# Altium schematic sheet dianshe1yuanli.SchDoc
size A4
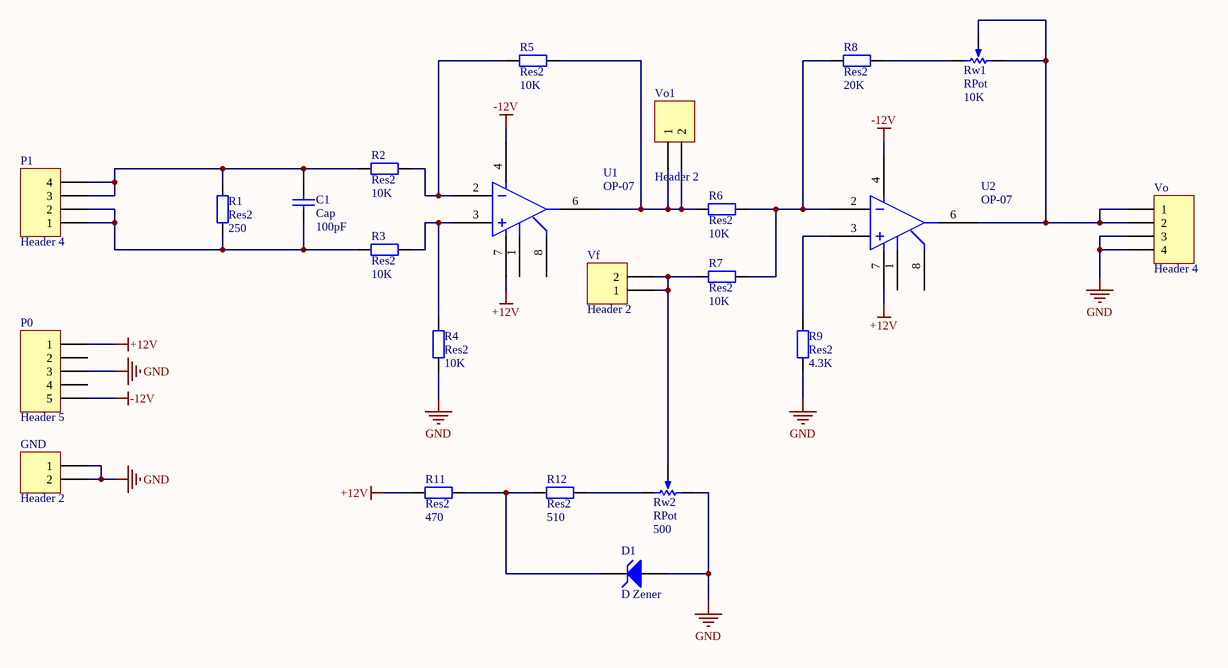
[diagram p0: dianshe1yuanli.SchDoc]

## Parts
C1  Cap  value 100pF  [RAD0.2]
D1  D Zener  [DIODE0.4]
GND  Header 2  [SIP2]
P0  Header 5  [POWER PLUG5]
P1  Header 4  [SIP4]
R1  Res2  value 250  [AXIAL-0.4]
R2  Res2  value 10K  [AXIAL-0.4]
R3  Res2  value 10K  [AXIAL-0.4]
R4  Res2  value 10K  [AXIAL-0.4]
R5  Res2  value 10K  [AXIAL-0.4]
R6  Res2  value 10K  [AXIAL-0.4]
R7  Res2  value 10K  [AXIAL-0.4]
R8  Res2  value 20K  [AXIAL-0.4]
R9  Res2  value 4.3K  [AXIAL-0.4]
R11  Res2  value 470  [AXIAL-0.4]
R12  Res2  value 510  [AXIAL-0.4]
Rw1  RPot  value 10K  [VR5]
Rw2  RPot  value 500  [VR5]
U1  OP-07  [DIP-8]
U2  OP-07  [DIP-8]
Vf  Header 2  [SIP2]
Vo  Header 4  [SIP4]
Vo1  Header 2  [SIP2]

## Nets
+12V: P0.1 R11.1 U1.7 U2.7
-12V: P0.5 U1.4 U2.4
GND: D1.1(A) GND.1 GND.2 P0.3 R4.1 R9.1 Rw2.1(TOP) Vo.3 Vo.4
NetC1_1: C1.1 P1.1 P1.2 R1.1 R3.1
NetC1_2: C1.2 P1.3 P1.4 R1.2 R2.1
NetD1_2: D1.2(K) R11.2 R12.1
NetR2_2: R2.2 R5.1 U1.2
NetR3_2: R3.2 R4.2 U1.3
NetR5_2: R5.2 R6.1 U1.6 Vo1.1 Vo1.2
NetR6_2: R6.2 R7.2 R8.1 U2.2
NetR7_1: R7.1 Rw2.2(TAP) Vf.1 Vf.2
NetR8_2: R8.2 Rw1.3(BOT)
NetR9_2: R9.2 U2.3
NetR12_2: R12.2 Rw2.3(BOT)
NetRw1_1: Rw1.1(TOP) Rw1.2(TAP) U2.6 Vo.1 Vo.2

Not connected (* = marked no-connect by the designer): P0 2 4; U1 1 8; U2 1 8

## Library data of the parts
C1 = Cap: Capacitor; Published: 8-Jun-2000; LatestRevisionDate: 17-Jul-2002; LatestRevisionNote: Re-released for DXP Platform.; PackageReference: RAD-0.3; Publisher: Altium Limited
D1 = D Zener: Zener Diode; Published: 8-Jun-2000; LatestRevisionDate: 17-Jul-2002; LatestRevisionNote: Re-released for DXP Platform.; PackageReference: DIODE-0.7; Publisher: Altium Limited
GND Vf Vo1 = Header 2: Header, 2-Pin; LatestRevisionDate: 17-Jul-2002; LatestRevisionNote: Re-released for DXP Platform.; Publisher: Altium Limited
P0 = Header 5: Header, 5-Pin; LatestRevisionDate: 17-Jul-2002; LatestRevisionNote: Re-released for DXP Platform.; Publisher: Altium Limited
P1 Vo = Header 4: Header, 4-Pin; LatestRevisionDate: 17-Jul-2002; LatestRevisionNote: Re-released for DXP Platform.; Publisher: Altium Limited
R1-R9 R11 R12 = Res2: Resistor; Published: 8-Jun-2000; LatestRevisionDate: 17-Jul-2002; LatestRevisionNote: Re-released for DXP Platform.; PackageReference: AXIAL-0.4; Publisher: Altium Limited
Rw1 Rw2 = RPot: Potentiometer; Sim Note: Enter the Resistance value and the set point into parameter fields.; Set Position: 0.5; Published: 8-Jun-2000; LatestRevisionDate: 17-Jul-2002; LatestRevisionNote: Re-released for DXP Platform.; PackageReference: VR5; Publisher: Altium Limited